# EAGLE schematic EagleSchematic (EAGLE 9.2.2)
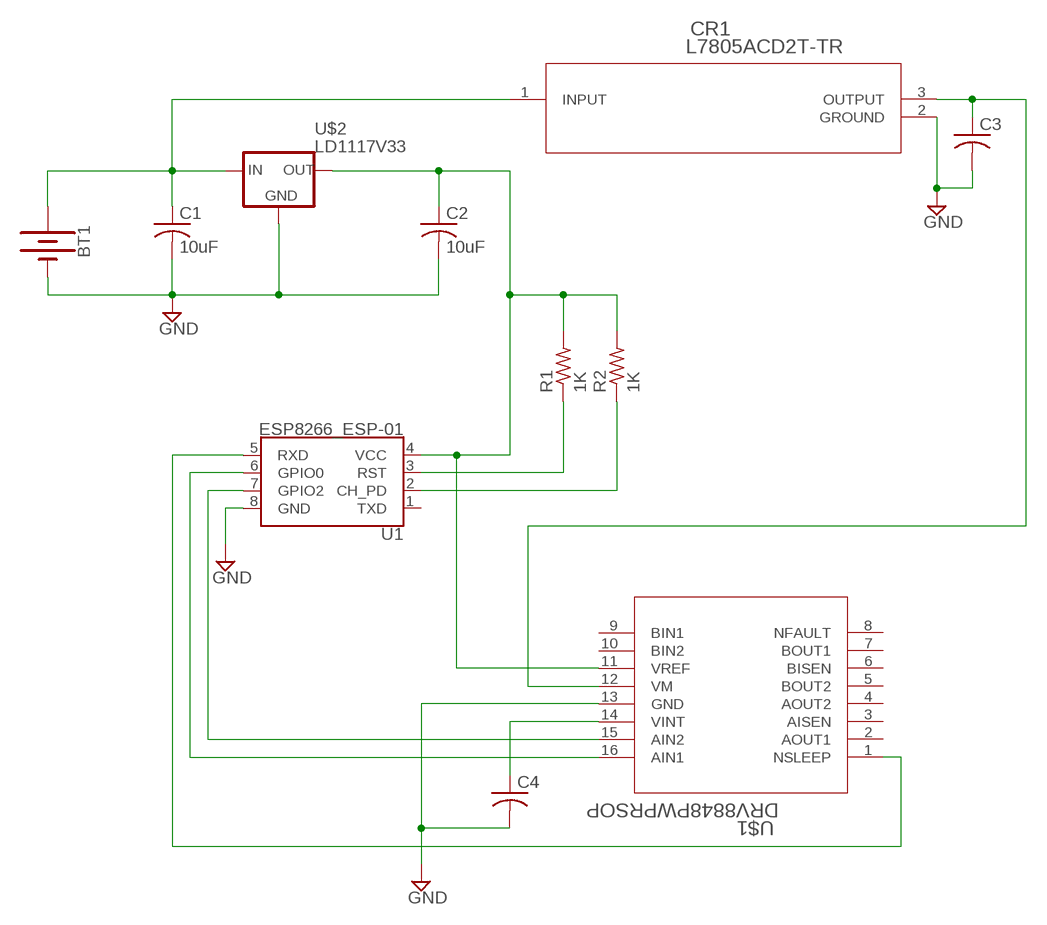
[diagram p0: schematic, sheet 1]

## Parts
BT1  BATTERY-9V  [BATTCON_9V]
C1  10uF  C-US025-024X044  [C025-024X044]
C2  10uF  C-US025-024X044  [C025-024X044]
C3  C-US025-024X044  [C025-024X044]
C4  C-US025-024X044  [C025-024X044]
CR1  L7805ACD2T-TR  [D2PAK]
R1  1K  R-US_0204/5  [0204/5]
R2  1K  R-US_0204/5  [0204/5]
U1  ESP8266_ESP-01  [ESP8266_ESP-01]
U$1  DRV8848PWPRSOP  [SOIC127P1032X265-16]
U$2  LD1117V33  [LD1117V33]

## Nets
3.3V: C2.1 R1.2 R2.2 U1.4(VCC) U$1.11(VREF) U$2.OUT
GND: C3.2 C4.2 CR1.2(GROUND) U1.8(GND) U$1.13(GND)
N$1: BT1.+ C1.1 CR1.1(INPUT) U$2.IN
N$2: BT1.- C1.2 C2.2 U$2.GND ; supply symbol labelled GND
N$3: C4.1 U$1.14(VINT)
N$4: R1.1 U1.3(RST)
N$5: R2.1 U1.2(CH_PD)
N$6: C3.1 CR1.3(OUTPUT) U$1.12(VM)
N$7: U1.7(GPIO2) U$1.15(AIN2)
N$8: U1.6(GPIO0) U$1.16(AIN1)
N$9: U1.5(RXD) U$1.1(NSLEEP)
Unconnected: U1.1(TXD) U$1.2(AOUT1) U$1.3(AISEN) U$1.4(AOUT2) U$1.5(BOUT2) U$1.6(BISEN) U$1.7(BOUT1) U$1.8(NFAULT) U$1.9(BIN1) U$1.10(BIN2)

## Library data of the parts
BT1 = SparkFun-Batteries:BATTERY: Battery - Single Cell A variety of battery chemistries, sizes, and footprints. Device List: 20MM_PTH - Coin Cell Battery Holder - 20mm (PTH) <https://www.sparkfun.com/products/783> 6.8MM_PTH - Coin Cell Battery Holder - 6.8MM(SMD) <https://www.digikey.com/product-detail/en/seiko-instruments/MS621FE-FL11E/728-1057-ND/1889208?WT.srch=1&gclid=CNOQ5a6LzdQCFZS2wAodXCkE0g> 12MM_SMD - Coin Cell Battery Holder - 12mm (SMD) <https://www.sparkfun.com/products/10592> 12MM_PTH - Coin Cell Battery Holder - 12mm (PTH) <https://www.sparkfun.com/products/7948> 20MM_SMD - 20mm Coin Cell Battery Holder (SMD) (2 legs) Used on the Big Time Watch Kit <https://www.sparkfun.com/products/11734> 20MM_SMD_4LEGS - Coin Cell Battery Holder - 20mm (SMD) <https://www.sparkfun.com/products/11892> 20MM_SMD_4LEGS_OVERPASTE - Coin Cell Battery Holder - 20mm (SMD) <https://www.sparkfun.com/products/11892> (Over-paste on the legs) 24.5MM_PTH - Coin Cell Battery Holder - 24.5mm (PTH) <https://www.sparkfun.com/products/8863> 9V - 9V Battery Holder - PC Mount Used on the SparkFun SparkPunk Sound Kit <https://www.sparkfun.com/products/11177> and SparkFun SparkPunk Sequencer Kit <https://www.sparkfun.com/products/12707> 18650 - Battery Holder - 18650 (PTH) <https://www.sparkfun.com/products/13113> AA - Battery Holder - 1xAA (PTH) <https://www.sparkfun.com/products/7949> AAA - Battery Holder - 1xAAA (PTH) <https://www.sparkfun.com/products/12718> AA_KIT - Battery Holder - 1xAA (PTH) <https://www.sparkfun.com/products/7949> Special kit package - pads only have exposed copper on one side of the board. AAA_KIT - Battery Holder - 1xAAA (PTH) <https://www.sparkfun.com/products/12718> Special kit package - pads only have exposed copper on one side of the board.; PROD_ID: BATT-10855
C1-C4 = VicMaster:C-US: CAPACITOR, American symbol
CR1 = L7805ACD:L7805ACD2T-TR; MANUFACTURER_PART_NUMBER: L7805ACD2TTR; VENDOR: STMicroelectronics
R1 R2 = VicMaster:R-US_: RESISTOR, American symbol
U1 = SparkFun-RF:ESP8266_ESP-01: ESP8266 ESP-01 Module The ESP8266 WiFi Module is a self contained SOC with integrated TCP/IP protocol stack that can give any microcontroller access to your WiFi network. The ESP8266 is capable of either hosting an application or offloading all Wi-Fi networking functions from another application processor. Each ESP8266 module comes pre-programmed with an AT command set firmware, meaning, you can simply hook this up to your Arduino device and get about as much WiFi-ability as a WiFi Shield offers (and that’s just out of the box)! The ESP8266 module is an extremely cost effective board with a huge, and ever growing, community. This module has a powerful enough on-board processing and storage capability that allows it to be integrated with the sensors and other application specific devices through its GPIOs with minimal development up-front and minimal loading during runtime. Its high degree of on-chip integration allows for minimal external circuitry, including the front-end module, is designed to occupy minimal PCB area. The ESP8266 supports APSD for VoIP applications and Bluetooth co-existance interfaces, it contains a self-calibrated RF allowing it to work under all operating conditions, and requires no external RF parts. SparkFun Product Page <https://www.sparkfun.com/products/13678>; SF_ID: WRL-13678
U$1 = DRV8848PWPR:DRV8848PWPR
U$2 = LD1117V33:LD1117V33